# Altium schematic sheet ADC_FILTER.SchDoc
size 209 x 297 mm
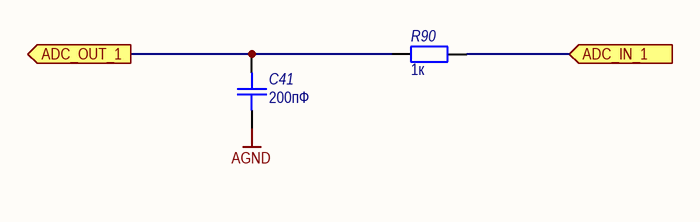
[diagram p0: ADC_FILTER.SchDoc]

## Parts
C41  200пФ  [SMD_0805]
R90  1к  [SMD_0805]

## Ports
ADC_IN_1 (in), ADC_OUT_1 (out)

## Nets
AGND: C41.1
ADC_IN_1: R90.2 ; port ADC_IN_1
ADC_OUT_1: C41.2 R90.1 ; port ADC_OUT_1

## Notes on the sheet
- Подп. и дата
- Инв. № дубл.
- Взам. инв. №
- Инв. № подл.
- Изм.
- Лист
- № докум.
- Подп.
- Дата
- Форма 2а ГОСТ 2.104-2006
- Копировал
- Формат А4

## Library data of the parts
C41 = Capacitor: Назначение: SMD-конденсатор; Наименование: Конденсатор; Потребление, Вт: 0; Value: 0,1мкФ
R90 = Resistor: Наименование: Резистор; Назначение: SMD-резистор; Потребление, Вт: 0,001; Value: 1к